# EAGLE schematic tf536 (EAGLE 9.6.2)

## Sheet 1 of 3
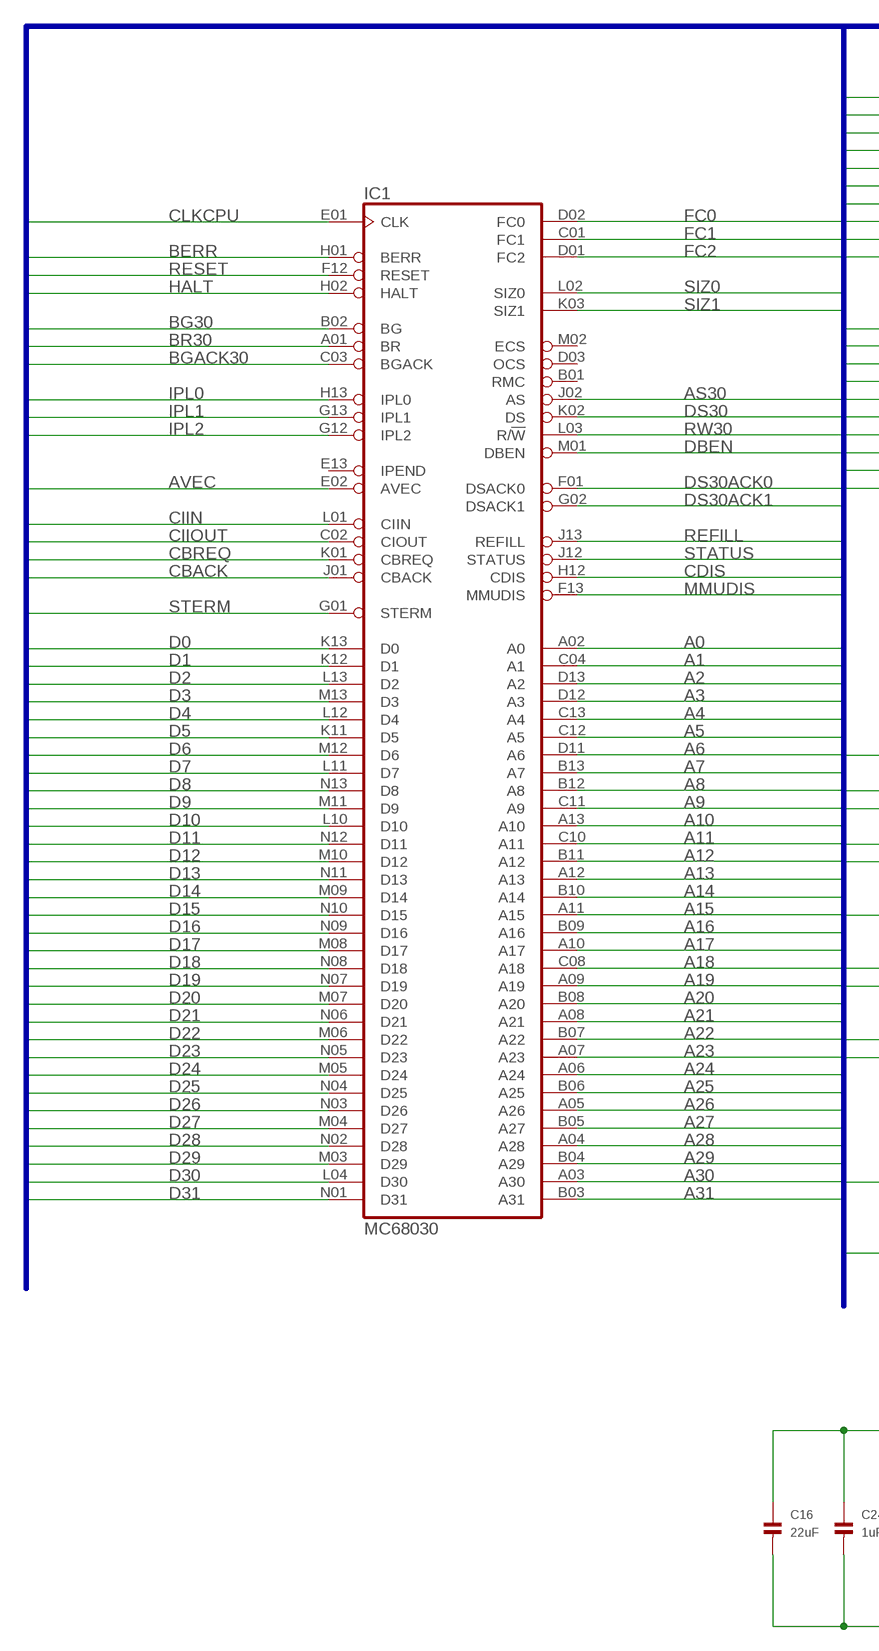
[diagram p0: schematic, sheet 1, part 1 of 2]
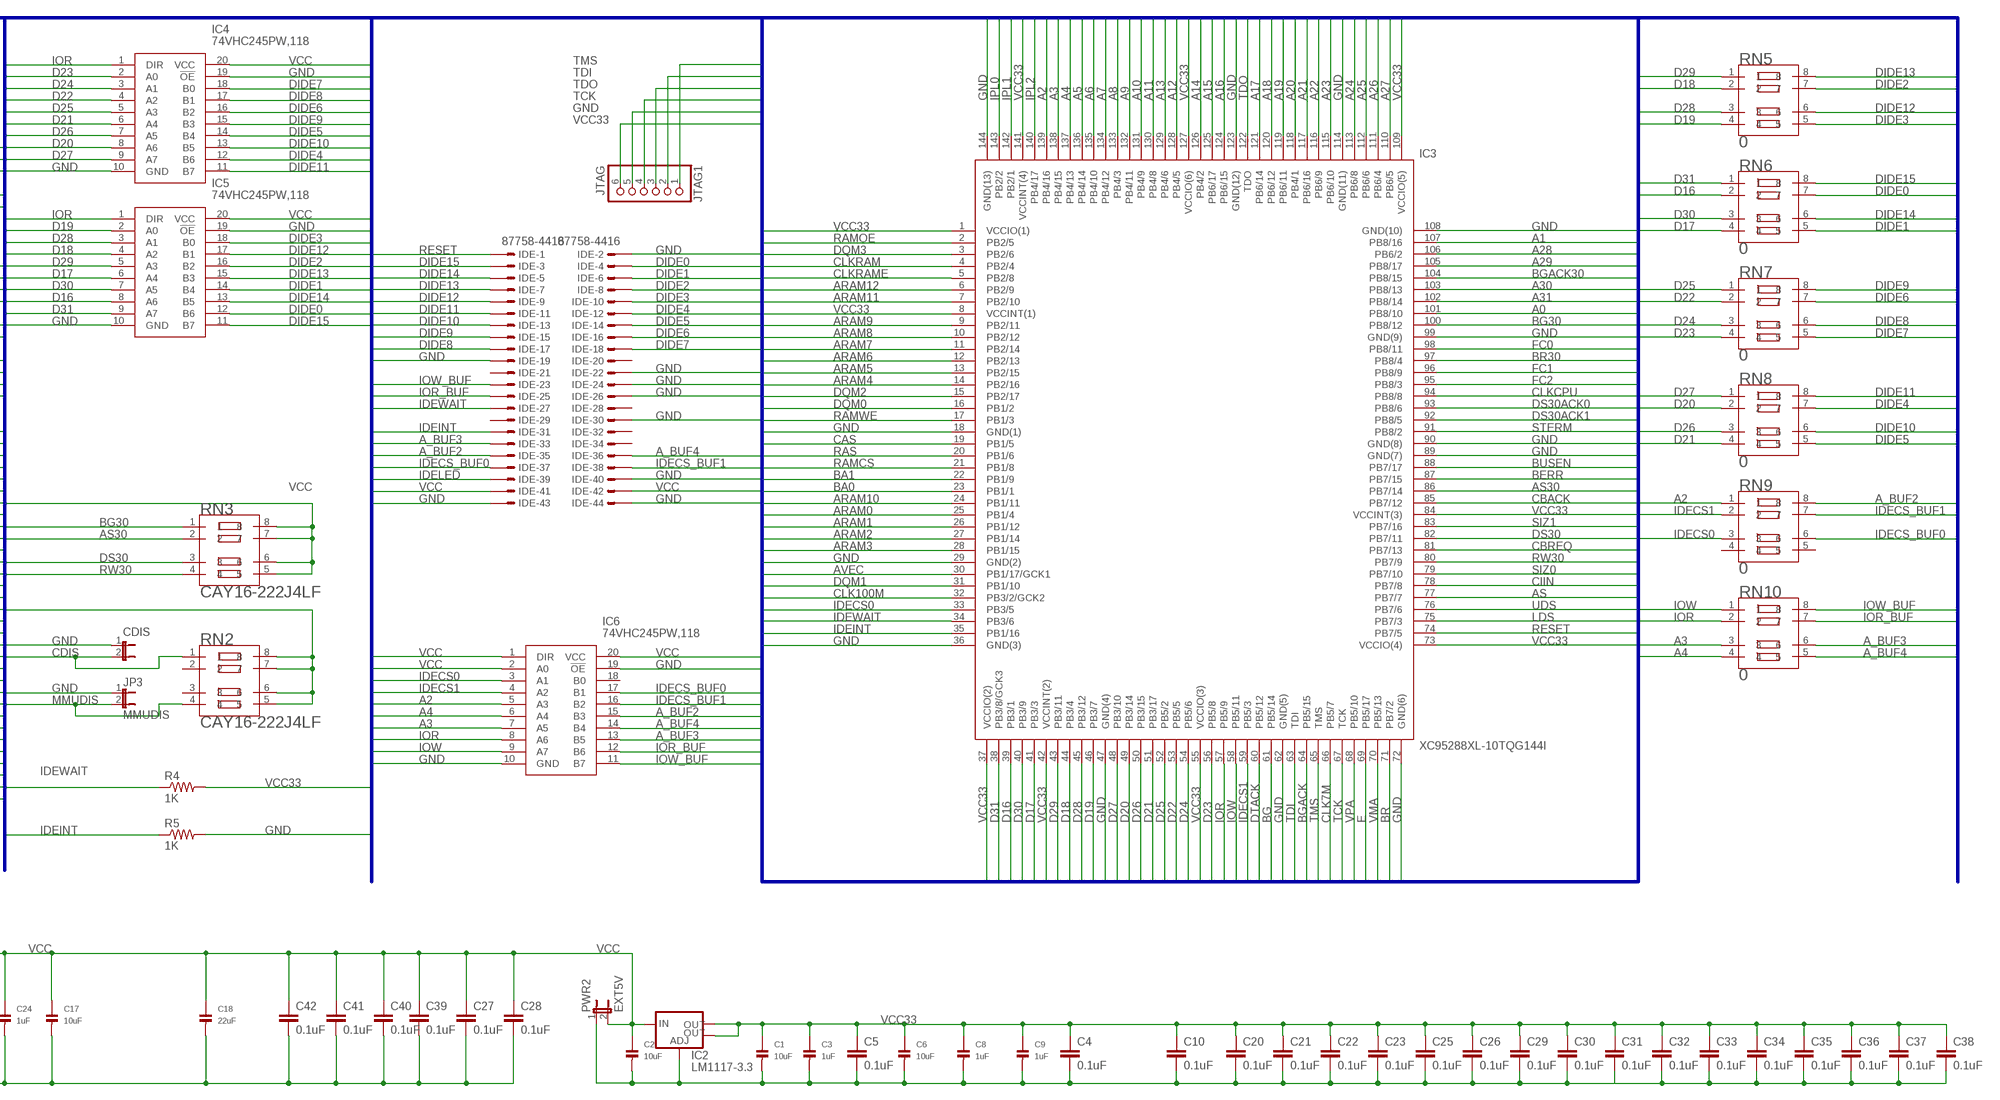
[diagram p1: schematic, sheet 1, part 2 of 2]

### Parts
C1  10uF  CAP_CERAMIC1206  [1206]
C2  10uF  CAP_CERAMIC1206  [1206]
C3  1uF  CAP_CERAMIC1206  [1206]
C4  0.1uF  0.1UF-25V(+80/-20%)(0603)  [0603-CAP]
C5  0.1uF  0.1UF-25V(+80/-20%)(0603)  [0603-CAP]
C6  10uF  CAP_CERAMIC1206  [1206]
C8  1uF  CAP_CERAMIC1206  [1206]
C9  1uF  CAP_CERAMIC1206  [1206]
C10  0.1uF  0.1UF-25V(+80/-20%)(0603)  [0603-CAP]
C16  22uF  CAP_CERAMIC1206  [1206]
C17  10uF  CAP_CERAMIC1206  [1206]
C18  22uF  CAP_CERAMIC1206  [1206]
C20  0.1uF  0.1UF-25V(+80/-20%)(0603)  [0603-CAP]
C21  0.1uF  0.1UF-25V(+80/-20%)(0603)  [0603-CAP]
C22  0.1uF  0.1UF-25V(+80/-20%)(0603)  [0603-CAP]
C23  0.1uF  0.1UF-25V(+80/-20%)(0603)  [0603-CAP]
C24  1uF  CAP_CERAMIC1206  [1206]
C25  0.1uF  0.1UF-25V(+80/-20%)(0603)  [0603-CAP]
C26  0.1uF  0.1UF-25V(+80/-20%)(0603)  [0603-CAP]
C27  0.1uF  0.1UF-25V(+80/-20%)(0603)  [0603-CAP]
C28  0.1uF  0.1UF-25V(+80/-20%)(0603)  [0603-CAP]
C29  0.1uF  0.1UF-25V(+80/-20%)(0603)  [0603-CAP]
C30  0.1uF  0.1UF-25V(+80/-20%)(0603)  [0603-CAP]
C31  0.1uF  0.1UF-25V(+80/-20%)(0603)  [0603-CAP]
C32  0.1uF  0.1UF-25V(+80/-20%)(0603)  [0603-CAP]
C33  0.1uF  0.1UF-25V(+80/-20%)(0603)  [0603-CAP]
C34  0.1uF  0.1UF-25V(+80/-20%)(0603)  [0603-CAP]
C35  0.1uF  0.1UF-25V(+80/-20%)(0603)  [0603-CAP]
C36  0.1uF  0.1UF-25V(+80/-20%)(0603)  [0603-CAP]
C37  0.1uF  0.1UF-25V(+80/-20%)(0603)  [0603-CAP]
C38  0.1uF  0.1UF-25V(+80/-20%)(0603)  [0603-CAP]
C39  0.1uF  0.1UF-25V(+80/-20%)(0603)  [0603-CAP]
C40  0.1uF  0.1UF-25V(+80/-20%)(0603)  [0603-CAP]
C41  0.1uF  0.1UF-25V(+80/-20%)(0603)  [0603-CAP]
C42  0.1uF  0.1UF-25V(+80/-20%)(0603)  [0603-CAP]
IC1  MC68030  MC68030RC  [MPGA128]
IC2  LM1117-3.3  V_REG_LM1117SOT223  [SOT223]
IC3  XC95288XL-10TQG144I  SAMACSYS_PARTS_XC95144XL-10TQG144I  [SAMACSYS_PARTS_QFP50P2200X2200X160-144N]
IC4  74VHC245PW,118  [SOP65P640X110-20N]
IC5  74VHC245PW,118  [SOP65P640X110-20N]
IC6  74VHC245PW,118  [SOP65P640X110-20N]
IDE  87758-4416  [87758-4416]
JP3  MMUDIS  JUMPER-2PTH  [1X02]
JP5  CDIS  JUMPER-2PTH  [1X02]
JTAG1  JTAG  HEADER-1X6ROUND  [1X06_ROUND]
PWR2  EXT5V  JUMPER-2PTH  [1X02]
R4  1K  0.05OHM-1/5W-1%(0603)  [0603]
R5  1K  0.05OHM-1/5W-1%(0603)  [0603]
RN2  CAY16-222J4LF  CAY16-103J4LF  [RESCAXE80P320X160-8N]
RN3  CAY16-222J4LF  CAY16-103J4LF  [RESCAXE80P320X160-8N]
RN5  0  CAY16-103J4LF  [RESCAXE80P320X160-8N]
RN6  0  CAY16-103J4LF  [RESCAXE80P320X160-8N]
RN7  0  CAY16-103J4LF  [RESCAXE80P320X160-8N]
RN8  0  CAY16-103J4LF  [RESCAXE80P320X160-8N]
RN9  0  CAY16-103J4LF  [RESCAXE80P320X160-8N]
RN10  0  CAY16-103J4LF  [RESCAXE80P320X160-8N]

### Nets
A0: IC1.A02(A0) IC3.101(PB8/10)
A1: IC1.C04(A1) IC3.107(PB8/16) ; also sheet 3
A2: IC1.D13(A2) IC3.139(PB4/16) IC6.5(A3) RN9.1 ; also sheet 3
A3: IC1.D12(A3) IC3.138(PB4/15) IC6.7(A5) RN10.3 ; also sheet 3
A4: IC1.C13(A4) IC3.137(PB4/13) IC6.6(A4) RN10.4 ; also sheet 3
A5: IC1.C12(A5) IC3.136(PB4/14) ; also sheet 3
A6: IC1.D11(A6) IC3.135(PB4/10) ; also sheet 3
A7: IC1.B13(A7) IC3.134(PB4/12) ; also sheet 3
A8: IC1.B12(A8) IC3.133(PB4/3) ; also sheet 3
A9: IC1.C11(A9) IC3.132(PB4/11) ; also sheet 3
A10: IC1.A13(A10) IC3.131(PB4/9) ; also sheet 3
A11: IC1.C10(A11) IC3.130(PB4/8) ; also sheet 3
A12: IC1.B11(A12) IC3.128(PB4/5) ; also sheet 3
A13: IC1.A12(A13) IC3.129(PB4/6) ; also sheet 3
A14: IC1.B10(A14) IC3.126(PB4/2) ; also sheet 3
A15: IC1.A11(A15) IC3.125(PB6/17) ; also sheet 3
A16: IC1.B09(A16) IC3.124(PB6/15) ; also sheet 3
A17: IC1.A10(A17) IC3.121(PB6/14) ; also sheet 3
A18: IC1.C08(A18) IC3.120(PB6/12) ; also sheet 3
A19: IC1.A09(A19) IC3.119(PB6/11) ; also sheet 3
A20: IC1.B08(A20) IC3.118(PB4/1) ; also sheet 3
A21: IC1.A08(A21) IC3.117(PB6/16) ; also sheet 3
A22: IC1.B07(A22) IC3.116(PB6/9) ; also sheet 3
A23: IC1.A07(A23) IC3.115(PB6/10) ; also sheet 3
A24: IC1.A06(A24) IC3.113(PB6/8) ; also sheet 2
A25: IC1.B06(A25) IC3.112(PB6/6) ; also sheet 2
A26: IC1.A05(A26) IC3.111(PB6/4) ; also sheet 2
A27: IC1.B05(A27) IC3.110(PB6/5) ; also sheet 2
A28: IC1.A04(A28) IC3.106(PB6/2) ; also sheet 2
A29: IC1.B04(A29) IC3.105(PB8/17) ; also sheet 2
A30: IC1.A03(A30) IC3.103(PB8/13) ; also sheet 2
A31: IC1.B03(A31) IC3.102(PB8/14) ; also sheet 2
A_BUF2: IC6.15(B3) IDE.35 RN9.8
A_BUF3: IC6.13(B5) IDE.33 RN10.6
A_BUF4: IC6.14(B4) IDE.36 RN10.5
ARAM0: IC3.25(PB1/4) ; also sheet 2
ARAM1: IC3.26(PB1/12) ; also sheet 2
ARAM2: IC3.27(PB1/14) ; also sheet 2
ARAM3: IC3.28(PB1/15) ; also sheet 2
ARAM4: IC3.14(PB2/16) ; also sheet 2
ARAM5: IC3.13(PB2/15) ; also sheet 2
ARAM6: IC3.12(PB2/13) ; also sheet 2
ARAM7: IC3.11(PB2/14) ; also sheet 2
ARAM8: IC3.10(PB2/12) ; also sheet 2
ARAM9: IC3.9(PB2/11) ; also sheet 2
ARAM10: IC3.24(PB1/11) ; also sheet 2
ARAM11: IC3.7(PB2/10) ; also sheet 2
ARAM12: IC3.6(PB2/9) ; also sheet 2
AS: IC3.77(PB7/7) ; also sheet 3
AS30: IC1.J02(AS) IC3.86(PB7/14) RN3.2
AVEC: IC1.E02(AVEC) IC3.30(PB1/17/GCK1)
BA0: IC3.23(PB1/1) ; also sheet 2
BA1: IC3.22(PB1/9) ; also sheet 2
BERR: IC1.H01(BERR) IC3.87(PB7/15) ; also sheet 3
BG: IC3.61(PB5/14) ; also sheet 3
BG30: IC1.B02(BG) IC3.100(PB8/12) RN3.1
BGACK: IC3.64(PB5/15) ; also sheet 3
BGACK30: IC1.C03(BGACK) IC3.104(PB8/15)
BR: IC3.71(PB7/2) ; also sheet 3
BR30: IC1.A01(BR) IC3.97(PB8/4)
BUSEN: IC3.88(PB7/17) ; also sheet 3
CAS: IC3.19(PB1/5) ; also sheet 2
CBACK: IC1.J01(CBACK) IC3.85(PB7/12)
CBREQ: IC1.K01(CBREQ) IC3.81(PB7/13)
CDIS: IC1.H12(CDIS) JP5.2 RN2.1
CIIN: IC1.L01(CIIN) IC3.78(PB7/8)
CIIOUT: IC1.C02(CIOUT)
CLK7M: IC3.66(PB5/7) ; also sheet 3
CLK100M: IC3.32(PB3/2/GCK2) ; also sheet 2
CLKCPU: IC1.E01(CLK) IC3.94(PB8/8)
CLKRAM: IC3.4(PB2/4) ; also sheet 2
CLKRAME: IC3.5(PB2/8) ; also sheet 2
D0: IC1.K13(D0) ; also sheet 2
D1: IC1.K12(D1) ; also sheet 2
D2: IC1.L13(D2) ; also sheet 2
D3: IC1.M13(D3) ; also sheet 2
D4: IC1.L12(D4) ; also sheet 2
D5: IC1.K11(D5) ; also sheet 2
D6: IC1.M12(D6) ; also sheet 2
D7: IC1.L11(D7) ; also sheet 2
D8: IC1.N13(D8) ; also sheet 2
D9: IC1.M11(D9) ; also sheet 2
D10: IC1.L10(D10) ; also sheet 2
D11: IC1.N12(D11) ; also sheet 2
D12: IC1.M10(D12) ; also sheet 2
D13: IC1.N11(D13) ; also sheet 2
D14: IC1.M09(D14) ; also sheet 2
D15: IC1.N10(D15) ; also sheet 2
D16: IC1.N09(D16) IC3.39(PB3/1) IC5.8(A6) RN6.2 ; also sheet 2,3
D17: IC1.M08(D17) IC3.41(PB3/3) IC5.6(A4) RN6.4 ; also sheet 2,3
D18: IC1.N08(D18) IC3.44(PB3/4) IC5.4(A2) RN5.2 ; also sheet 2,3
D19: IC1.N07(D19) IC3.46(PB3/7) IC5.2(A0) RN5.4 ; also sheet 2,3
D20: IC1.M07(D20) IC3.49(PB3/14) IC4.8(A6) RN8.2 ; also sheet 2,3
D21: IC1.N06(D21) IC3.51(PB3/17) IC4.6(A4) RN8.4 ; also sheet 2,3
D22: IC1.M06(D22) IC3.53(PB5/5) IC4.4(A2) RN7.2 ; also sheet 2,3
D23: IC1.N05(D23) IC3.56(PB5/8) IC4.2(A0) RN7.4 ; also sheet 2,3
D24: IC1.M05(D24) IC3.54(PB5/6) IC4.3(A1) RN7.3 ; also sheet 2,3
D25: IC1.N04(D25) IC3.52(PB5/2) IC4.5(A3) RN7.1 ; also sheet 2,3
D26: IC1.N03(D26) IC3.50(PB3/15) IC4.7(A5) RN8.3 ; also sheet 2,3
D27: IC1.M04(D27) IC3.48(PB3/10) IC4.9(A7) RN8.1 ; also sheet 2,3
D28: IC1.N02(D28) IC3.45(PB3/12) IC5.3(A1) RN5.3 ; also sheet 2,3
D29: IC1.M03(D29) IC3.43(PB3/11) IC5.5(A3) RN5.1 ; also sheet 2,3
D30: IC1.L04(D30) IC3.40(PB3/9) IC5.7(A5) RN6.3 ; also sheet 2,3
D31: IC1.N01(D31) IC3.38(PB3/8/GCK3) IC5.9(A7) RN6.1 ; also sheet 2,3
DBEN: IC1.M01(DBEN)
DIDE0: IC5.12(B6) IDE.4 RN6.7
DIDE1: IC5.14(B4) IDE.6 RN6.5
DIDE2: IC5.16(B2) IDE.8 RN5.7
DIDE3: IC5.18(B0) IDE.10 RN5.5
DIDE4: IC4.12(B6) IDE.12 RN8.7
DIDE5: IC4.14(B4) IDE.14 RN8.5
DIDE6: IC4.16(B2) IDE.16 RN7.7
DIDE7: IC4.18(B0) IDE.18 RN7.5
DIDE8: IC4.17(B1) IDE.17 RN7.6
DIDE9: IC4.15(B3) IDE.15 RN7.8
DIDE10: IC4.13(B5) IDE.13 RN8.6
DIDE11: IC4.11(B7) IDE.11 RN8.8
DIDE12: IC5.17(B1) IDE.9 RN5.6
DIDE13: IC5.15(B3) IDE.7 RN5.8
DIDE14: IC5.13(B5) IDE.5 RN6.6
DIDE15: IC5.11(B7) IDE.3 RN6.8
DQM0: IC3.16(PB1/2) ; also sheet 2
DQM1: IC3.31(PB1/10) ; also sheet 2
DQM2: IC3.15(PB2/17) ; also sheet 2
DQM3: IC3.3(PB2/6) ; also sheet 2
DS30: IC1.K02(DS) IC3.82(PB7/11) RN3.3
DS30ACK0: IC1.F01(DSACK0) IC3.93(PB8/6)
DS30ACK1: IC1.G02(DSACK1) IC3.92(PB8/5)
DTACK: IC3.60(PB5/12) ; also sheet 3
E: IC3.69(PB5/17) ; also sheet 3
FC0: IC1.D02(FC0) IC3.98(PB8/11) ; also sheet 3
FC1: IC1.C01(FC1) IC3.96(PB8/9) ; also sheet 3
FC2: IC1.D01(FC2) IC3.95(PB8/3) ; also sheet 3
GND: C1.2 C2.2 C3.2 C4.2 C5.2 C6.2 C8.2 C9.2 C10.2 C16.2 C17.2 C18.2 C20.2 C21.2 C22.2 C23.2 C24.2 C25.2 C26.2 C27.2 C28.2 C29.2 C30.2 C31.2 C32.2 C33.2 C34.2 C35.2 C36.2 C37.2 C38.2 C39.2 C40.2 C41.2 C42.2 IC2.1(ADJ) IC3.18(GND(1)) IC3.29(GND(2)) IC3.36(GND(3)) IC3.47(GND(4)) IC3.62(GND(5)) IC3.72(GND(6)) IC3.89(GND(7)) IC3.90(GND(8)) IC3.99(GND(9)) IC3.108(GND(10)) IC3.114(GND(11)) IC3.123(GND(12)) IC3.144(GND(13)) IC4.10(GND) IC4.19(!OE) IC5.10(GND) IC5.19(!OE) IC6.10(GND) IC6.19(!OE) IDE.2 IDE.19 IDE.22 IDE.24 IDE.26 IDE.30 IDE.40 IDE.43 IDE.44 JP3.1 JP5.1 JTAG1.5 PWR2.1 R5.2 ; also sheet 2,3
HALT: IC1.H02(HALT) ; also sheet 3
IDECS0: IC3.33(PB3/5) IC6.3(A1) RN9.3
IDECS1: IC3.59(PB5/3) IC6.4(A2) RN9.2
IDECS_BUF0: IC6.17(B1) IDE.37 RN9.6
IDECS_BUF1: IC6.16(B2) IDE.38 RN9.7
IDEINT: IC3.35(PB1/16) IDE.31 R5.1
IDELED: IDE.39
IDEWAIT: IC3.34(PB3/6) IDE.27 R4.1
IOR: IC3.57(PB5/9) IC4.1(DIR) IC5.1(DIR) IC6.8(A6) RN10.2
IOR_BUF: IC6.12(B6) IDE.25 RN10.7
IOW: IC3.58(PB5/11) IC6.9(A7) RN10.1
IOW_BUF: IC6.11(B7) IDE.23 RN10.8
IPL0: IC1.H13(IPL0) IC3.143(PB2/2) ; also sheet 3
IPL1: IC1.G13(IPL1) IC3.142(PB2/1) ; also sheet 3
IPL2: IC1.G12(IPL2) IC3.140(PB4/17) ; also sheet 3
LDS: IC3.75(PB7/3) ; also sheet 3
MMUDIS: IC1.F13(MMUDIS) JP3.2 RN2.4
RAMCS: IC3.21(PB1/8) ; also sheet 2
RAMOE: IC3.2(PB2/5) ; also sheet 2
RAMWE: IC3.17(PB1/3) ; also sheet 2
RAS: IC3.20(PB1/6) ; also sheet 2
REFILL: IC1.J13(REFILL)
RESET: IC1.F12(RESET) IC3.74(PB7/5) IDE.1 ; also sheet 3
RW30: IC1.L03(R/!W) IC3.80(PB7/9) RN3.4 ; also sheet 3
SIZ0: IC1.L02(SIZ0) IC3.79(PB7/10)
SIZ1: IC1.K03(SIZ1) IC3.83(PB7/16)
STATUS: IC1.J12(STATUS)
STERM: IC1.G01(STERM) IC3.91(PB8/2)
TCK: IC3.67(TCK) JTAG1.4
TDI: IC3.63(TDI) JTAG1.2
TDO: IC3.122(TDO) JTAG1.3
TMS: IC3.65(TMS) JTAG1.1
UDS: IC3.76(PB7/6) ; also sheet 3
VCC: C2.1 C16.1 C17.1 C18.1 C24.1 C27.1 C28.1 C39.1 C40.1 C41.1 C42.1 IC2.3(IN) IC4.20(VCC) IC5.20(VCC) IC6.1(DIR) IC6.2(A0) IC6.20(VCC) IDE.41 IDE.42 PWR2.2 RN3.5 RN3.6 RN3.7 RN3.8 ; also sheet 3
VCC33: C1.1 C3.1 C4.1 C5.1 C6.1 C8.1 C9.1 C10.1 C20.1 C21.1 C22.1 C23.1 C25.1 C26.1 C29.1 C30.1 C31.1 C32.1 C33.1 C34.1 C35.1 C36.1 C37.1 C38.1 IC2.2(OUT) IC2.4(OUT) IC3.1(VCCIO(1)) IC3.8(VCCINT(1)) IC3.37(VCCIO(2)) IC3.42(VCCINT(2)) IC3.55(VCCIO(3)) IC3.73(VCCIO(4)) IC3.84(VCCINT(3)) IC3.109(VCCIO(5)) IC3.127(VCCIO(6)) IC3.141(VCCINT(4)) JTAG1.6 R4.2 RN2.5 RN2.6 RN2.7 RN2.8 ; also sheet 2
VMA: IC3.70(PB5/13) ; also sheet 3
VPA: IC3.68(PB5/10) ; also sheet 3
Unconnected: IC1.B01(RMC) IC1.D03(OCS) IC1.E13(IPEND) IC1.M02(ECS) IC6.18(B0) IDE.20 IDE.21 IDE.28 IDE.29 IDE.32 IDE.34 RN2.2 RN2.3 RN9.4 RN9.5

### Buses
A[0..31],A_BUF[2..4],ACTIVE,AGND,ARAM[0..12],AS,AS20,AS30,AUX[0..1],AVEC,BA[0..1],BERR,BG,BG20,BG30,BGACK,BGACK20,BGACK30,BR,BR20,BR30,BUSEN,CAS,CBACK,CBREQ,CDIS,CFGIN,CFGOUT,CIIN,CIIOUT,CLK7M,CLK14M,CLK50M,CLK100M,CLKCPU,CLKRAM,CLKRAME,D[0..31],DBEN,DIDE[0..15],DQM[0..3],DRAM[0..31],DS20,DS30,DS30ACK[0..1],DSACK[0..1],DTACK,E,FC[0..2],FIRE[0..1],GND,HALT,IDECS,IDECS[0..1],IDECS_BUF[0..1],IDEINT,IDEINT_CLEAN,IDELED,IDEWAIT,INT2,INT6,INTCYCLE,IOR,IOR_BUF,IOW,IOW_BUF,IPL[0..2],LDS,MMUDIS,PUNT,RAMCS,RAMOE,RAMWE,RAS,REFILL,RESET,R/W,RW20,RW30,RXD,RXD_EXT,SIZ[0..1],SPARE,STATUS,STERM,TCK,TDI,TDO,TMS,TXD,TXD_EXT,UDS,VCC,VCC33,VMA,VPA

## Sheet 2 of 3
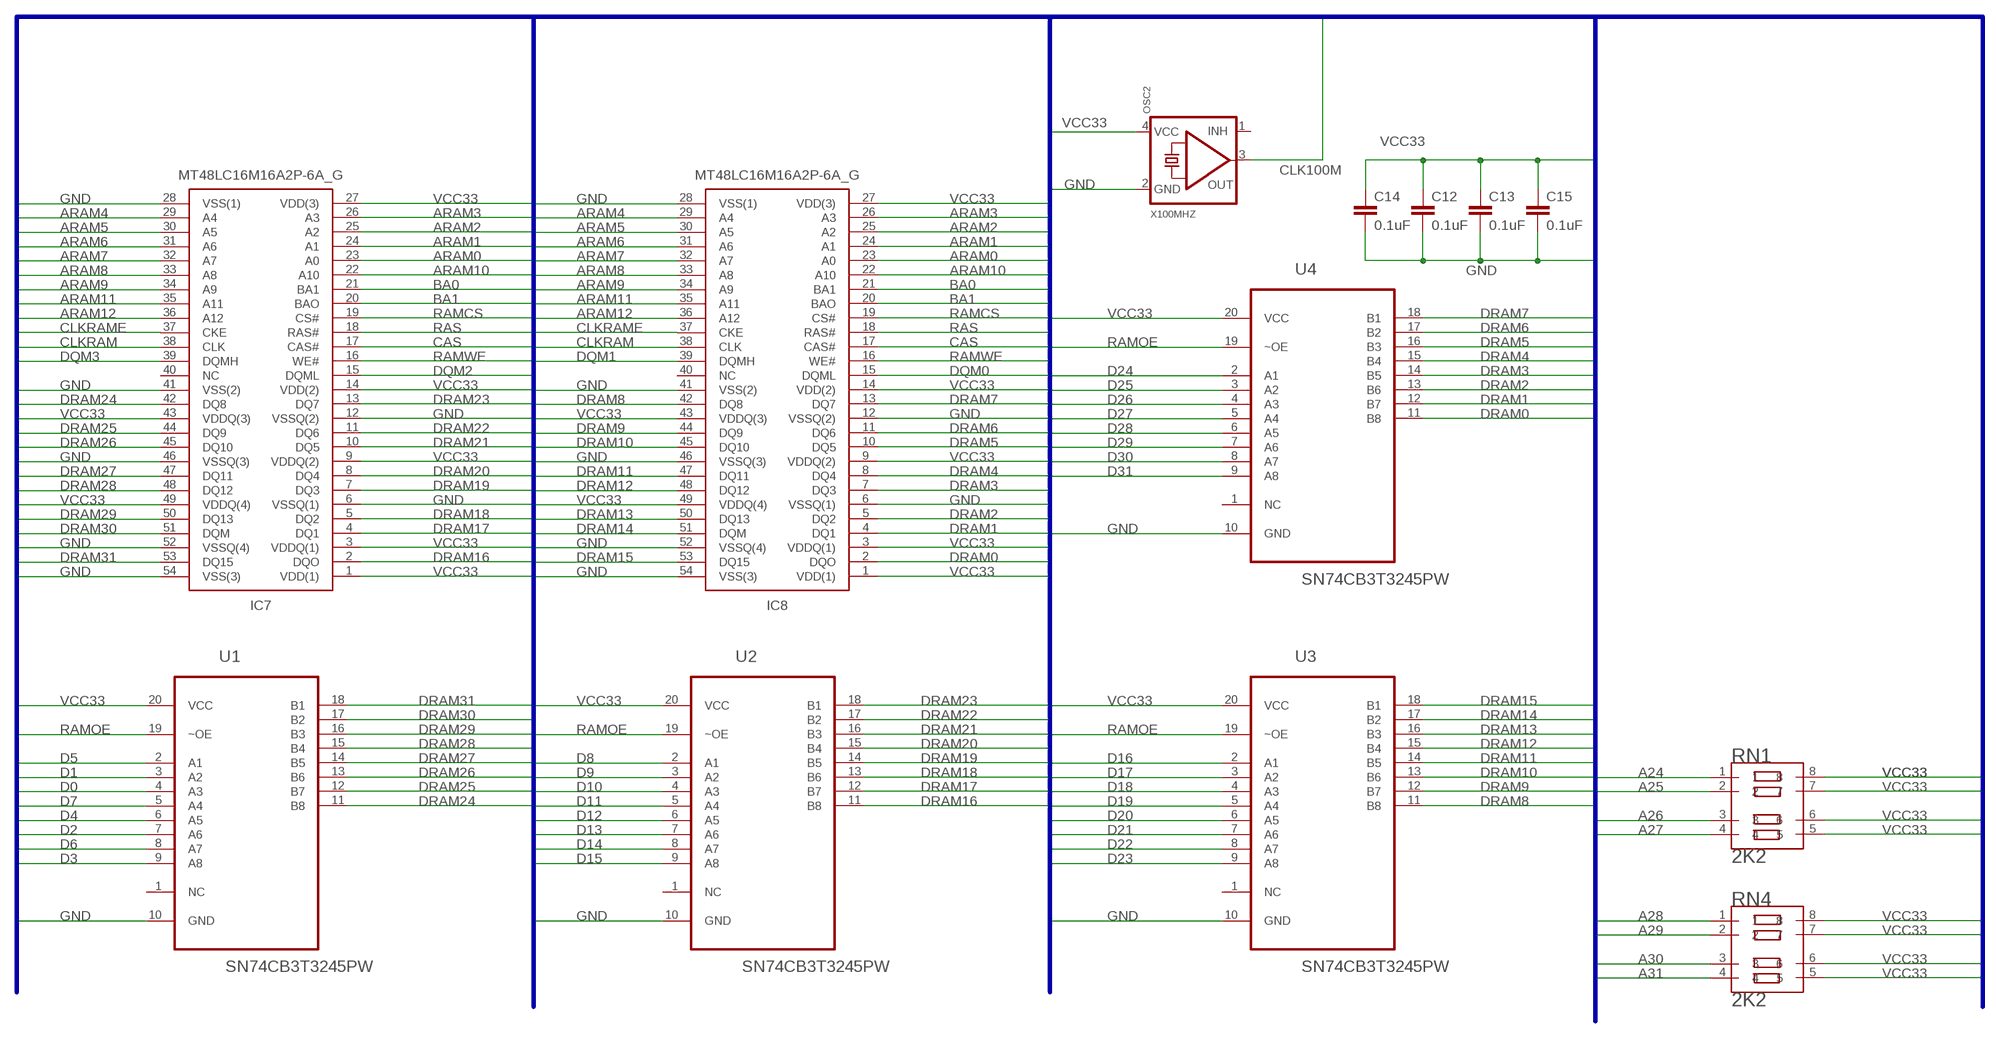
[diagram p2: schematic, sheet 2]

### Parts
C12  0.1uF  0.1UF-25V(+80/-20%)(0603)  [0603-CAP]
C13  0.1uF  0.1UF-25V(+80/-20%)(0603)  [0603-CAP]
C14  0.1uF  0.1UF-25V(+80/-20%)(0603)  [0603-CAP]
C15  0.1uF  0.1UF-25V(+80/-20%)(0603)  [0603-CAP]
IC7  MT48LC16M16A2P-6A_G  [SOP80P1176X120-54N]
IC8  MT48LC16M16A2P-6A_G  [SOP80P1176X120-54N]
OSC2  X100MHZ  OSCILLATOR  [OSC_7X5MM]
RN1  2K2  CAY16-103J4LF  [RESCAXE80P320X160-8N]
RN4  2K2  CAY16-103J4LF  [RESCAXE80P320X160-8N]
U1  SN74CB3T3245PW  [SOP65P640X120-20N]
U2  SN74CB3T3245PW  [SOP65P640X120-20N]
U3  SN74CB3T3245PW  [SOP65P640X120-20N]
U4  SN74CB3T3245PW  [SOP65P640X120-20N]

### Nets
A24: RN1.1 ; also sheet 1
A25: RN1.2 ; also sheet 1
A26: RN1.3 ; also sheet 1
A27: RN1.4 ; also sheet 1
A28: RN4.1 ; also sheet 1
A29: RN4.2 ; also sheet 1
A30: RN4.3 ; also sheet 1
A31: RN4.4 ; also sheet 1
ARAM0: IC7.23(A0) IC8.23(A0) ; also sheet 1
ARAM1: IC7.24(A1) IC8.24(A1) ; also sheet 1
ARAM2: IC7.25(A2) IC8.25(A2) ; also sheet 1
ARAM3: IC7.26(A3) IC8.26(A3) ; also sheet 1
ARAM4: IC7.29(A4) IC8.29(A4) ; also sheet 1
ARAM5: IC7.30(A5) IC8.30(A5) ; also sheet 1
ARAM6: IC7.31(A6) IC8.31(A6) ; also sheet 1
ARAM7: IC7.32(A7) IC8.32(A7) ; also sheet 1
ARAM8: IC7.33(A8) IC8.33(A8) ; also sheet 1
ARAM9: IC7.34(A9) IC8.34(A9) ; also sheet 1
ARAM10: IC7.22(A10) IC8.22(A10) ; also sheet 1
ARAM11: IC7.35(A11) IC8.35(A11) ; also sheet 1
ARAM12: IC7.36(A12) IC8.36(A12) ; also sheet 1
BA0: IC7.21(BA1) IC8.21(BA1) ; also sheet 1
BA1: IC7.20(BAO) IC8.20(BAO) ; also sheet 1
CAS: IC7.17(CAS#) IC8.17(CAS#) ; also sheet 1
CLK100M: OSC2.3(OUT) ; also sheet 1
CLKRAM: IC7.38(CLK) IC8.38(CLK) ; also sheet 1
CLKRAME: IC7.37(CKE) IC8.37(CKE) ; also sheet 1
D0: U1.4(A3) ; also sheet 1
D1: U1.3(A2) ; also sheet 1
D2: U1.7(A6) ; also sheet 1
D3: U1.9(A8) ; also sheet 1
D4: U1.6(A5) ; also sheet 1
D5: U1.2(A1) ; also sheet 1
D6: U1.8(A7) ; also sheet 1
D7: U1.5(A4) ; also sheet 1
D8: U2.2(A1) ; also sheet 1
D9: U2.3(A2) ; also sheet 1
D10: U2.4(A3) ; also sheet 1
D11: U2.5(A4) ; also sheet 1
D12: U2.6(A5) ; also sheet 1
D13: U2.7(A6) ; also sheet 1
D14: U2.8(A7) ; also sheet 1
D15: U2.9(A8) ; also sheet 1
D16: U3.2(A1) ; also sheet 1,3
D17: U3.3(A2) ; also sheet 1,3
D18: U3.4(A3) ; also sheet 1,3
D19: U3.5(A4) ; also sheet 1,3
D20: U3.6(A5) ; also sheet 1,3
D21: U3.7(A6) ; also sheet 1,3
D22: U3.8(A7) ; also sheet 1,3
D23: U3.9(A8) ; also sheet 1,3
D24: U4.2(A1) ; also sheet 1,3
D25: U4.3(A2) ; also sheet 1,3
D26: U4.4(A3) ; also sheet 1,3
D27: U4.5(A4) ; also sheet 1,3
D28: U4.6(A5) ; also sheet 1,3
D29: U4.7(A6) ; also sheet 1,3
D30: U4.8(A7) ; also sheet 1,3
D31: U4.9(A8) ; also sheet 1,3
DQM0: IC8.15(DQML) ; also sheet 1
DQM1: IC8.39(DQMH) ; also sheet 1
DQM2: IC7.15(DQML) ; also sheet 1
DQM3: IC7.39(DQMH) ; also sheet 1
DRAM0: IC8.2(DQO) U4.11(B8)
DRAM1: IC8.4(DQ1) U4.12(B7)
DRAM2: IC8.5(DQ2) U4.13(B6)
DRAM3: IC8.7(DQ3) U4.14(B5)
DRAM4: IC8.8(DQ4) U4.15(B4)
DRAM5: IC8.10(DQ5) U4.16(B3)
DRAM6: IC8.11(DQ6) U4.17(B2)
DRAM7: IC8.13(DQ7) U4.18(B1)
DRAM8: IC8.42(DQ8) U3.11(B8)
DRAM9: IC8.44(DQ9) U3.12(B7)
DRAM10: IC8.45(DQ10) U3.13(B6)
DRAM11: IC8.47(DQ11) U3.14(B5)
DRAM12: IC8.48(DQ12) U3.15(B4)
DRAM13: IC8.50(DQ13) U3.16(B3)
DRAM14: IC8.51(DQM) U3.17(B2)
DRAM15: IC8.53(DQ15) U3.18(B1)
DRAM16: IC7.2(DQO) U2.11(B8)
DRAM17: IC7.4(DQ1) U2.12(B7)
DRAM18: IC7.5(DQ2) U2.13(B6)
DRAM19: IC7.7(DQ3) U2.14(B5)
DRAM20: IC7.8(DQ4) U2.15(B4)
DRAM21: IC7.10(DQ5) U2.16(B3)
DRAM22: IC7.11(DQ6) U2.17(B2)
DRAM23: IC7.13(DQ7) U2.18(B1)
DRAM24: IC7.42(DQ8) U1.11(B8)
DRAM25: IC7.44(DQ9) U1.12(B7)
DRAM26: IC7.45(DQ10) U1.13(B6)
DRAM27: IC7.47(DQ11) U1.14(B5)
DRAM28: IC7.48(DQ12) U1.15(B4)
DRAM29: IC7.50(DQ13) U1.16(B3)
DRAM30: IC7.51(DQM) U1.17(B2)
DRAM31: IC7.53(DQ15) U1.18(B1)
GND: C12.2 C13.2 C14.2 C15.2 IC7.6(VSSQ(1)) IC7.12(VSSQ(2)) IC7.28(VSS(1)) IC7.41(VSS(2)) IC7.46(VSSQ(3)) IC7.52(VSSQ(4)) IC7.54(VSS(3)) IC8.6(VSSQ(1)) IC8.12(VSSQ(2)) IC8.28(VSS(1)) IC8.41(VSS(2)) IC8.46(VSSQ(3)) IC8.52(VSSQ(4)) IC8.54(VSS(3)) OSC2.2(GND) U1.10(GND) U2.10(GND) U3.10(GND) U4.10(GND) ; also sheet 1,3
RAMCS: IC7.19(CS#) IC8.19(CS#) ; also sheet 1
RAMOE: U1.19(~OE) U2.19(~OE) U3.19(~OE) U4.19(~OE) ; also sheet 1
RAMWE: IC7.16(WE#) IC8.16(WE#) ; also sheet 1
RAS: IC7.18(RAS#) IC8.18(RAS#) ; also sheet 1
VCC33: C12.1 C13.1 C14.1 C15.1 IC7.1(VDD(1)) IC7.3(VDDQ(1)) IC7.9(VDDQ(2)) IC7.14(VDD(2)) IC7.27(VDD(3)) IC7.43(VDDQ(3)) IC7.49(VDDQ(4)) IC8.1(VDD(1)) IC8.3(VDDQ(1)) IC8.9(VDDQ(2)) IC8.14(VDD(2)) IC8.27(VDD(3)) IC8.43(VDDQ(3)) IC8.49(VDDQ(4)) OSC2.4(VCC) RN1.5 RN1.6 RN1.7 RN1.8 RN4.5 RN4.6 RN4.7 RN4.8 U1.20(VCC) U2.20(VCC) U3.20(VCC) U4.20(VCC) ; also sheet 1
Unconnected: IC7.40(NC) IC8.40(NC) OSC2.1(INH) U1.1(NC) U2.1(NC) U3.1(NC) U4.1(NC)

### Buses
A[0..31],A_BUF[2..4],ACTIVE,AGND,ARAM[0..12],AS,AS20,AS30,AUX[0..1],AVEC,BA[0..1],BERR,BG,BG20,BG30,BGACK,BGACK20,BGACK30,BR,BR20,BR30,BUSEN,CAS,CBACK,CBREQ,CDIS,CFGIN,CFGOUT,CIIN,CIIOUT,CLK7M,CLK14M,CLK50M,CLK100M,CLKCPU,CLKRAM,CLKRAME,D[0..31],DBEN,DIDE[0..15],DQM[0..3],DRAM[0..31],DS20,DS30,DS30ACK[0..1],DSACK[0..1],DTACK,E,FC[0..2],FIRE[0..1],GND,HALT,IDECS,IDECS[0..1],IDECS_BUF[0..1],IDEINT,IDEINT_CLEAN,IDELED,IDEWAIT,INT2,INT6,INTCYCLE,IOR,IOR_BUF,IOW,IOW_BUF,IPL[0..2],LDS,MMUDIS,PUNT,RAMCS,RAMOE,RAMWE,RAS,REFILL,RESET,R/W,RW20,RW30,RXD,RXD_EXT,SIZ[0..1],SPARE,STATUS,STERM,TCK,TDI,TDO,TMS,TXD,TXD_EXT,UDS,VCC,VCC33,VMA,VPA

## Sheet 3 of 3
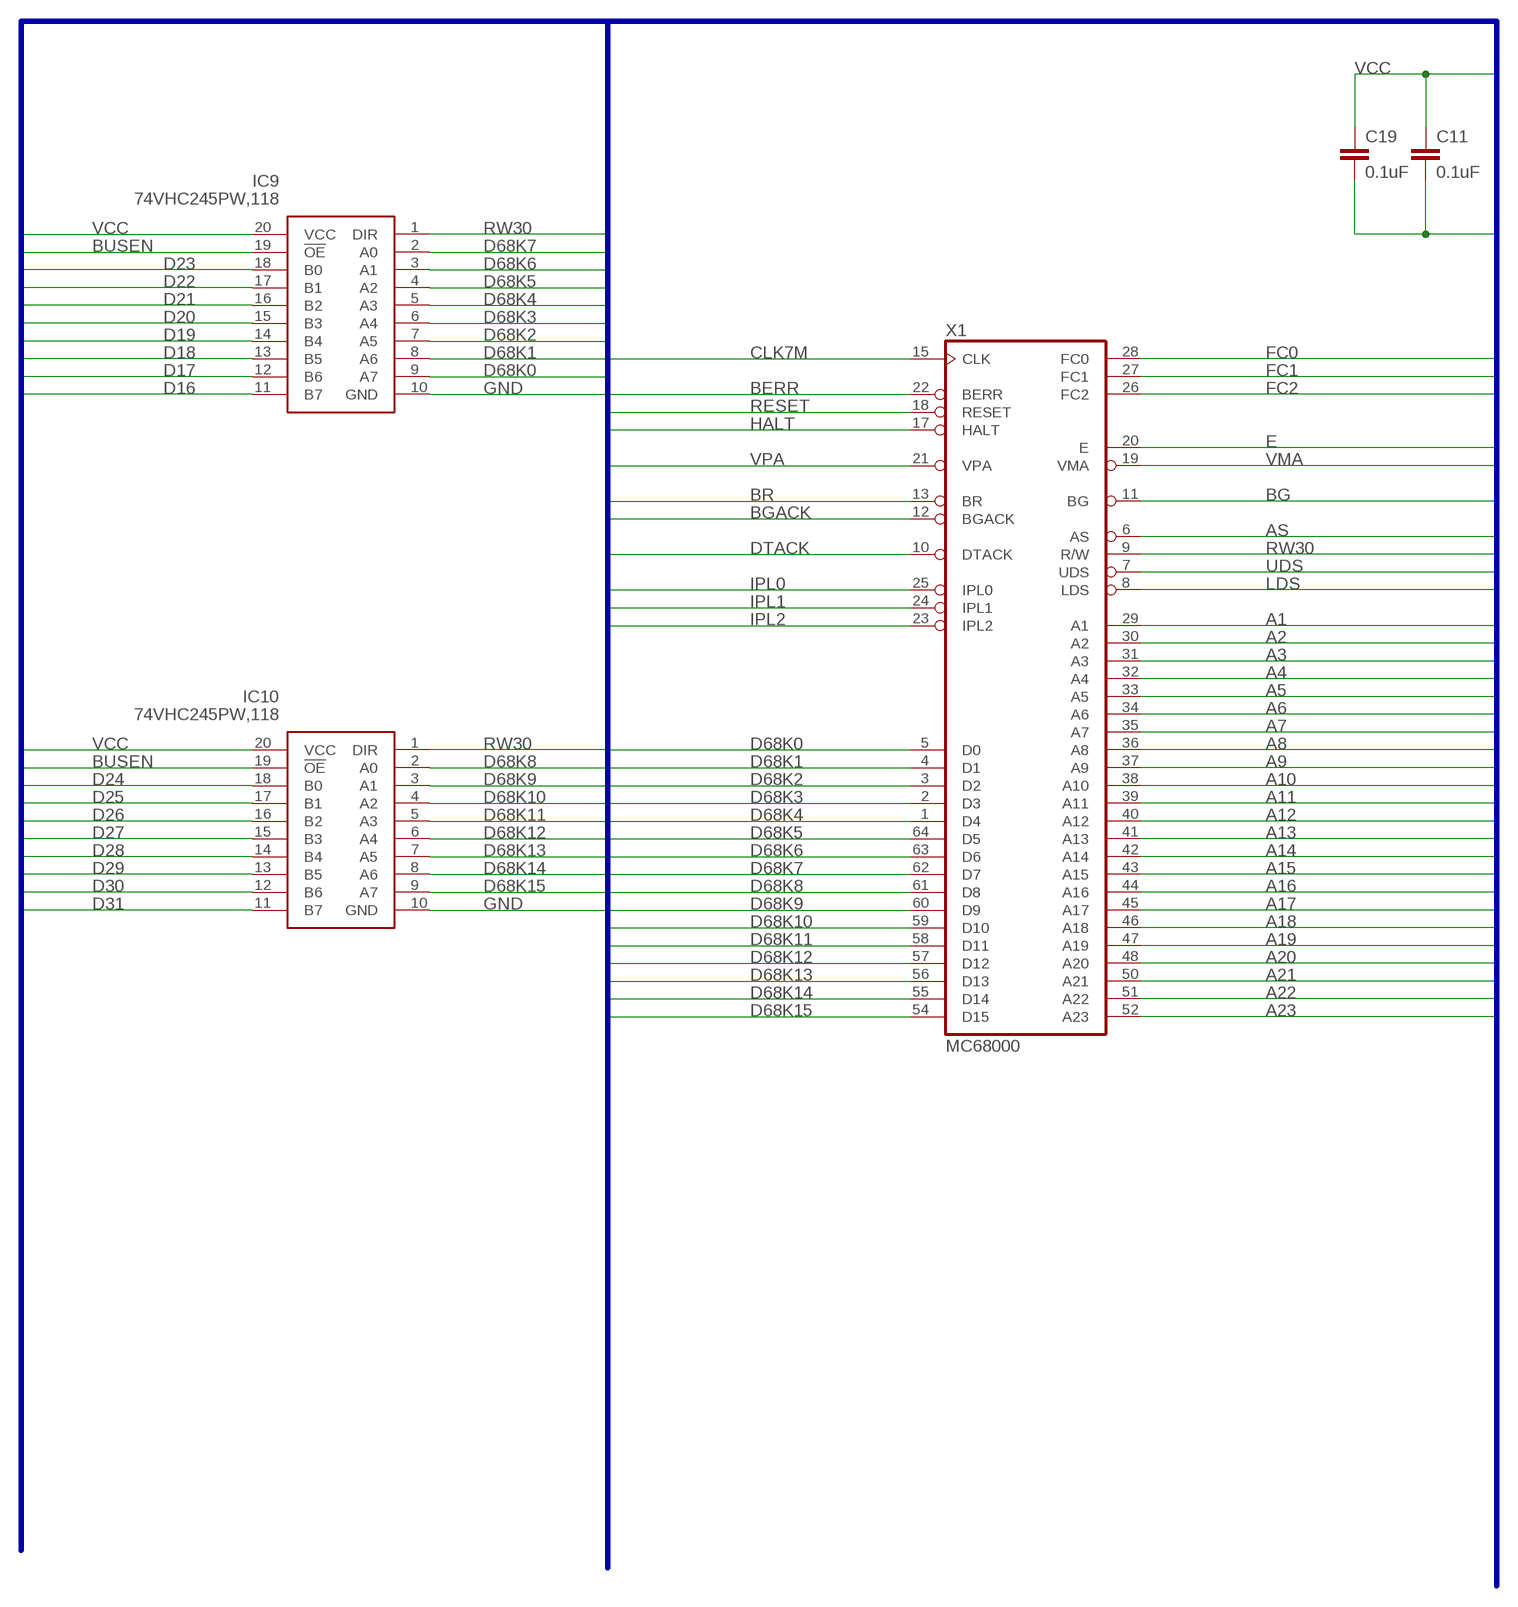
[diagram p3: schematic, sheet 3]

### Parts
C11  0.1uF  0.1UF-25V(+80/-20%)(0603)  [0603-CAP]
C19  0.1uF  0.1UF-25V(+80/-20%)(0603)  [0603-CAP]
IC9  74VHC245PW,118  [SOP65P640X110-20N]
IC10  74VHC245PW,118  [SOP65P640X110-20N]
X1  MC68000  MC68000P  [DIL64]

### Nets
A1: X1.29(A1) ; also sheet 1
A2: X1.30(A2) ; also sheet 1
A3: X1.31(A3) ; also sheet 1
A4: X1.32(A4) ; also sheet 1
A5: X1.33(A5) ; also sheet 1
A6: X1.34(A6) ; also sheet 1
A7: X1.35(A7) ; also sheet 1
A8: X1.36(A8) ; also sheet 1
A9: X1.37(A9) ; also sheet 1
A10: X1.38(A10) ; also sheet 1
A11: X1.39(A11) ; also sheet 1
A12: X1.40(A12) ; also sheet 1
A13: X1.41(A13) ; also sheet 1
A14: X1.42(A14) ; also sheet 1
A15: X1.43(A15) ; also sheet 1
A16: X1.44(A16) ; also sheet 1
A17: X1.45(A17) ; also sheet 1
A18: X1.46(A18) ; also sheet 1
A19: X1.47(A19) ; also sheet 1
A20: X1.48(A20) ; also sheet 1
A21: X1.50(A21) ; also sheet 1
A22: X1.51(A22) ; also sheet 1
A23: X1.52(A23) ; also sheet 1
AS: X1.6(AS) ; also sheet 1
BERR: X1.22(BERR) ; also sheet 1
BG: X1.11(BG) ; also sheet 1
BGACK: X1.12(BGACK) ; also sheet 1
BR: X1.13(BR) ; also sheet 1
BUSEN: IC9.19(!OE) IC10.19(!OE) ; also sheet 1
CLK7M: X1.15(CLK) ; also sheet 1
D16: IC9.11(B7) ; also sheet 1,2
D17: IC9.12(B6) ; also sheet 1,2
D18: IC9.13(B5) ; also sheet 1,2
D19: IC9.14(B4) ; also sheet 1,2
D20: IC9.15(B3) ; also sheet 1,2
D21: IC9.16(B2) ; also sheet 1,2
D22: IC9.17(B1) ; also sheet 1,2
D23: IC9.18(B0) ; also sheet 1,2
D24: IC10.18(B0) ; also sheet 1,2
D25: IC10.17(B1) ; also sheet 1,2
D26: IC10.16(B2) ; also sheet 1,2
D27: IC10.15(B3) ; also sheet 1,2
D28: IC10.14(B4) ; also sheet 1,2
D29: IC10.13(B5) ; also sheet 1,2
D30: IC10.12(B6) ; also sheet 1,2
D31: IC10.11(B7) ; also sheet 1,2
D68K0: IC9.9(A7) X1.5(D0)
D68K1: IC9.8(A6) X1.4(D1)
D68K2: IC9.7(A5) X1.3(D2)
D68K3: IC9.6(A4) X1.2(D3)
D68K4: IC9.5(A3) X1.1(D4)
D68K5: IC9.4(A2) X1.64(D5)
D68K6: IC9.3(A1) X1.63(D6)
D68K7: IC9.2(A0) X1.62(D7)
D68K8: IC10.2(A0) X1.61(D8)
D68K9: IC10.3(A1) X1.60(D9)
D68K10: IC10.4(A2) X1.59(D10)
D68K11: IC10.5(A3) X1.58(D11)
D68K12: IC10.6(A4) X1.57(D12)
D68K13: IC10.7(A5) X1.56(D13)
D68K14: IC10.8(A6) X1.55(D14)
D68K15: IC10.9(A7) X1.54(D15)
DTACK: X1.10(DTACK) ; also sheet 1
E: X1.20(E) ; also sheet 1
FC0: X1.28(FC0) ; also sheet 1
FC1: X1.27(FC1) ; also sheet 1
FC2: X1.26(FC2) ; also sheet 1
GND: C11.2 C19.2 IC9.10(GND) IC10.10(GND) ; also sheet 1,2
HALT: X1.17(HALT) ; also sheet 1
IPL0: X1.25(IPL0) ; also sheet 1
IPL1: X1.24(IPL1) ; also sheet 1
IPL2: X1.23(IPL2) ; also sheet 1
LDS: X1.8(LDS) ; also sheet 1
RESET: X1.18(RESET) ; also sheet 1
RW30: IC9.1(DIR) IC10.1(DIR) X1.9(R/W) ; also sheet 1
UDS: X1.7(UDS) ; also sheet 1
VCC: C11.1 C19.1 IC9.20(VCC) IC10.20(VCC) ; also sheet 1
VMA: X1.19(VMA) ; also sheet 1
VPA: X1.21(VPA) ; also sheet 1

### Buses
A[0..31],AGND,AS,AS20,AVEC,BERR,BG,BG20,BGACK,BR,BURST[2..3],BUSEN,CBACK,CBREQ,CDIS,CIIN,CIIOUT,CLK7M,CLKCPU,CPCS,CPSENSE,D[0..31],D68K[0..15],DBEN,DS20,DSACK[0..1],DTACK,E,FC[0..2],GND,HALT,IDECS[0..1],IDEINT,IDEIOEN,IDELED,IDEWAIT,INT2,INTCYCLE,IOR,IOW,IPL[0..2],LDS,MMUDIS,OVL,RAMCS[0..3],RAMOE,REFILL,RESET,R/W,R/W20,RW30,SIZ[0..1],SPARE,SPI_CLK,SPI_CS[0..1],SPI_MISO,SPI_MOSI,STATUS,STERM,TCK,TDI,TDINT,TDO,TMS,UDS,VCC,VCC18,VCC33,VMA,VPA

## Power pins joined to a net without a drawn wire
GND: IC1.C05(GND) IC1.C07(GND) IC1.C09(GND) IC1.E03(GND) IC1.E11(GND) IC1.F03(GND) IC1.G03(GND) IC1.G11(GND) IC1.J03(GND) IC1.J11(GND) IC1.L05(GND) IC1.L07(GND) IC1.L08(GND) IC1.L09(GND) X1.16(GND) X1.53(GND)
VCC: IC1.C06(VCC) IC1.D04(VCC) IC1.D10(VCC) IC1.F02(VCC) IC1.F11(VCC) IC1.H03(VCC) IC1.H11(VCC) IC1.K04(VCC) IC1.K10(VCC) IC1.L06(VCC) X1.14(VCC) X1.49(VCC)

## Library data of the parts
C1-C3 C6 C8 C9 C16-C18 C24 = microbuilder:CAP_CERAMIC: Ceramic Capacitors 0402 - 0402 Surface Mount Capacitors 16pF 50V 5% [Digikey: 445-4899-2-ND] 18pF 50V 5% [Digikey: 490-1281-2-ND] 22pF 50V 5% [Digikey: 490-1283-2-ND] 68pF 50V 5% [Digikey: 490-1289-2-ND] 0.1uF 10V 10% [Digikey: 490-1318-2-ND] 1.0uF 6.3V 10% [Digikey: 490-1320-2-ND] 0603 - 0603 Surface Mount Capacitors 16 pF 50V 5% [Digikey: 445-5051-2-ND] 22 pF 50V [Digikey: PCC220ACVTR-ND] 33 pF 50V 5% [Digikey: 490-1415-1-ND] 56pF 50V 5% [Digikey: 490-1421-1-ND] 220pF 50V 5% [Digikey: 445-1285-1-ND] 680 pF 50V 2200 pF 50V 5% C0G [Digikey: 445-1297-1-ND] 5600 pF 100V 5% X7R [Digikey: 478-3711-1-ND] 0.1 µF 25V 10% [Digikey: PCC2277TR-ND] 0.22 µF 16V 10% X7R [Digikey: 445-1318-1-ND] 1.0 µF 25V 10% [Digikey: 445-5146-2-ND] 0603 - RF Specific 3pF 250V +/-0.1pF RF [Digikey: 712-1347-1-ND] 18 pF 250V 5% [Digikey: 478-3505-1-ND or 712-1322-1-ND] 56 pF 250V 5% C0G RF [Digikey: 490-4867-1-ND] 68 pF 250V RF [Digikey: 490-4868-1-ND] 0805 - 0805 Surface Mount Capacitors 220 pF 250V 2% RF Ceramic Capacitor [Digikey: 712-1398-1-ND] 1000 pF 50V 2% NP0 Ceramic Capacitor [Digikey: 478-3760-1-ND] 0.1 µF 25V 10% Ceramic Capacitor [Digikey: PCC1828TR-ND] 1.0 µF 16V 10% Ceramic Capacitor[Digikey: 490-1691-2-ND] 10.0 µF 10V 10% Ceramic Capacitor[Digikey: 709-1228-1-ND] 10.0 uF 16V 10% Ceramic Capacitor [Digikey: 478-5165-2-ND] 47 uF 6.3V 20% Ceramic Capacitor [Digikey: 587-1779-1-ND or 399-5506-1-ND] 1206 - 1206 Surface Mount Capacitors 47uF 10V 20% Ceramic Capacitor [Digikey: 490-5528-1-ND or 399-5508-1-ND or 445-6010-1-ND] 100uF 6.3V -20%, +80% Y5V Ceramic Capacitor (Digikey: 490-4512-1-ND, Mouser: 81-GRM31CF50J107ZE1L)
C4 C5 C10-C15 C19-C23 C25-C42 = SparkFun-Capacitors:0.1UF-25V(+80/-20%)(0603): CAP-00810 Ceramic Standard decoupling cap; PROD_ID: CAP-00810
IC1 = micro-mc68000:MC68030RC: 68xxx PROCESSOR; MF: MOTOROLA; MPN: MC68030RC50C; OC_FARNELL: unknown; OC_NEWARK: 52F3269
IC2 = SparkFun-PowerIC:V_REG_LM1117: Voltage Regulator LM1117 Standard adjustable voltage regulator but in SMD form. Spark Fun Electronics SKU : COM-00595; PROD_ID: VREG-08170
IC3 = sjl540:SAMACSYS_PARTS_XC95144XL-10TQG144I: XC95144XL-10TQG144I XC95144XL-10TQG144I, CPLD XC9500XL Flash 144 Cells, 117 I/O, 8 Labs, ISP, 3 3.6 V 144-Pin TQFP <https://componentsearchengine.com/Images/3/XC95144XL-10TQG144I.jpg> Source: Datasheet <http://docs-europe.electrocomponents.com/webdocs/0c77/0900766b80c77f42.pdf>; DESCRIPTION: XC95144XL-10TQG144I XC95144XL-10TQG144I, CPLD XC9500XL Flash 144 Cells, 117 I/O, 8 Labs, ISP, 3 3.6 V 144-Pin TQFP; HEIGHT: 1.6mm; MANUFACTURER_NAME: XILINX; MANUFACTURER_PART_NUMBER: XC95144XL-10TQG144I; RS_PART_NUMBER: 6260624; SUPPLIER_NAME: RS
IC4-IC6 IC9 IC10 = 74VHC245PW_118:74VHC245PW,118: 74VHC(T)245 - Octal bus transceiver; 3-state@en-us Source: Datasheet <https://componentsearchengine.com/Datasheets/1/74VHC245PW,118.pdf>; DESCRIPTION: 74VHC(T)245 - Octal bus transceiver; 3-state@en-us; HEIGHT: 1.1mm; MANUFACTURER_NAME: Nexperia; MANUFACTURER_PART_NUMBER: 74VHC245PW,118; MOUSER_PART_NUMBER: 771-74VHC245PW118; MOUSER_PRICE-STOCK: https://www.mouser.com/Search/Refine.aspx?Keyword=771-74VHC245PW118
IC7 IC8 = SamacSys_Parts:MT48LC16M16A2P-6A_G: MT48LC16M16A2P-6A:G, SDRAM Memory 256mb Surface Mount, 3 3.6 V, 0 +70 C, 54-pin, TSOP <https://componentsearchengine.com/Images/3/MT48LC16M16A2P-6A_G.jpg> Source: Datasheet <http://www.micron.com/~/media/documents/products/data-sheet/dram/256mb_sdr.pdf>; DESCRIPTION: MT48LC16M16A2P-6A:G, SDRAM Memory 256mb Surface Mount, 3 3.6 V, 0 +70 C, 54-pin, TSOP; HEIGHT: 1.2mm; MANUFACTURER_NAME: Micron; MANUFACTURER_PART_NUMBER: MT48LC16M16A2P-6A:G; RS_PART_NUMBER: 7824553; SUPPLIER_NAME: RS
IDE = Hermes_development:87758-4416: 44 Pin - 2mm Dual Row Single Wafer, Vertical T/H HDR Source: http://www.molex.com/pdm_docs/sd/877580616_sd.pdf; MF: MOLEX; MPN: 87758-4416; OC_FARNELL: unknown; OC_NEWARK: 59J1588
JP3 JP5 PWR2 = SparkFun-Retired:JUMPER-2: Jumper Basic 0.1" spaced jumper. Use with breakaway headers.
JTAG1 = microbuilder:HEADER-1X6: PIN HEADER
OSC2 = microbuilder:OSCILLATOR: Oscillators 3.2x2.5mm SMT 4.0MHz +/- 50ppm, 3.3V, 9mA, -40/+85°C - Digikey: 535-9752-1-ND 50MHz +/- 50ppm, 3.3V, 8mA, -10/+70°C - Digikey: 478-4792-1-ND 5x7mm SMT 4.0MHz +/-20ppm 3.3V, 20mA, -20/+70°C - Digikey: 535-9329-2-ND 50MHz +/- 25ppm 3.3V, 35mA, -40/+85°C - Digikey: 631-1197-1-ND
R4 R5 = SparkFun-Resistors:0.05OHM-1/5W-1%(0603); PROD_ID: RES-12535
RN1-RN10 = CAY16-103J4LF:CAY16-103J4LF: Res Thick Film Array 10K Ohm 5% 200ppm/C ISOL Molded 8-Pin 1206(4 X 0603) Convex SMD Paper T/R; AVAILABILITY: Good; DESCRIPTION: Res Thick Film Array 10K Ohm 5% ?200ppm/C ISOL Molded 8-Pin 1206(4 X 0603) Convex SMD Paper T/R; MF: Bourns; MP: CAY16-103J4LF; PACKAGE: 1206 Bourns; PRICE: 0.02 USD
U1-U4 = SN74CB3T3245PW:SN74CB3T3245PW: 8-BIT FET BUS SWITCH; AVAILABILITY: Unavailable; DESCRIPTION: 8-Bit FET 2.5-V/3.3-V Low-Voltage Bus Switch With 5-V Tolerant Level Shifter 20-TSSOP -40 to 85; MF: Texas Instruments; MP: SN74CB3T3245PW; PACKAGE: TSSOP-20 Texas Instruments; PRICE: None
X1 = terriblefire:MC68000P: 68xxx PROCESSOR; OC_FARNELL: unknown; OC_NEWARK: unknown